# Altium schematic sheet HDMI.SchDoc
size A4
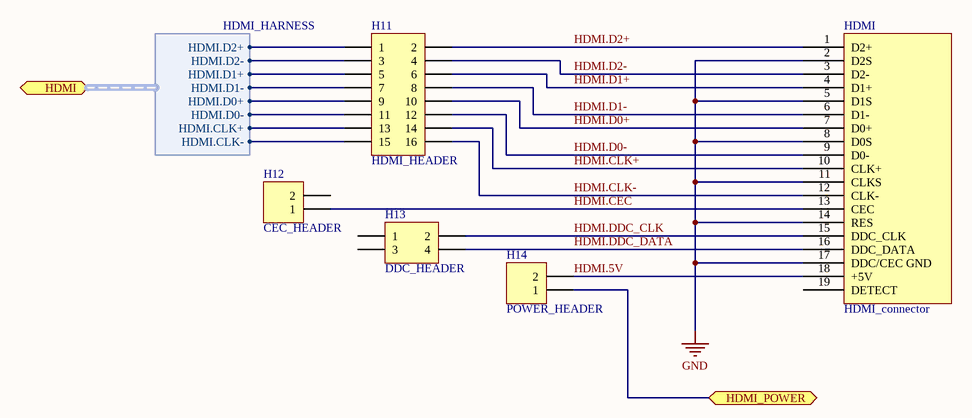
[diagram p0: HDMI.SchDoc]

## Parts
H11  HDMI_HEADER  [HDR2X8]
H12  CEC_HEADER  [HDR1X2]
H13  DDC_HEADER  [HDR2X2]
H14  POWER_HEADER  [HDR1X2]
HDMI  HDMI_connector  [HDMI-type-A]

## Ports
HDMI (harness HDMI_HARNESS), HDMI_POWER

## Harnesses
HDMI_HARNESS: HDMI.D2+, HDMI.D2-, HDMI.D1+, HDMI.D1-, HDMI.D0+, HDMI.D0-, HDMI.CLK+, HDMI.CLK-

## Nets
GND: HDMI.2(D2S) HDMI.5(D1S) HDMI.8(D0S) HDMI.11(CLKS) HDMI.14(RES) HDMI.17(DDC/CEC_GND)
HDMI.5V: H14.2 HDMI.18(+5V)
HDMI.CEC: H12.1 HDMI.13(CEC)
HDMI.CLK+: H11.14 HDMI.10(CLK+)
HDMI.CLK-: H11.16 HDMI.12(CLK-)
HDMI.D0+: H11.10 HDMI.7(D0+)
HDMI.D0-: H11.12 HDMI.9(D0-)
HDMI.D1+: H11.6 HDMI.4(D1+)
HDMI.D1-: H11.8 HDMI.6(D1-)
HDMI.D2+: H11.2 HDMI.1(D2+)
HDMI.D2-: H11.4 HDMI.3(D2-)
HDMI.DDC_CLK: H13.2 HDMI.15(DDC_CLK)
HDMI.DDC_DATA: H13.4 HDMI.16(DDC_DATA)
HDMI_POWER: H14.1 ; port HDMI_POWER
NetH11_1: H11.1 ; port HDMI.HDMI.D2+
NetH11_3: H11.3 ; port HDMI.HDMI.D2-
NetH11_5: H11.5 ; port HDMI.HDMI.D1+
NetH11_7: H11.7 ; port HDMI.HDMI.D1-
NetH11_9: H11.9 ; port HDMI.HDMI.D0+
NetH11_11: H11.11 ; port HDMI.HDMI.D0-
NetH11_13: H11.13 ; port HDMI.HDMI.CLK+
NetH11_15: H11.15 ; port HDMI.HDMI.CLK-

Not connected (* = marked no-connect by the designer): H12 2; H13 1 3; HDMI 19(DETECT)

## Library data of the parts
H11 = Header 8X2: Header, 8-Pin, Dual row; LatestRevisionDate: 17-Jul-2002; LatestRevisionNote: Re-released for DXP Platform.; Publisher: Altium Limited
H12 H14 = Header 2: Header, 2-Pin; LatestRevisionDate: 17-Jul-2002; LatestRevisionNote: Re-released for DXP Platform.; Publisher: Altium Limited
H13 = Header 2X2: Header, 2-Pin, Dual row; LatestRevisionDate: 17-Jul-2002; LatestRevisionNote: Re-released for DXP Platform.; Publisher: Altium Limited